# Altium schematic sheet CSGB.SchDoc
size A4
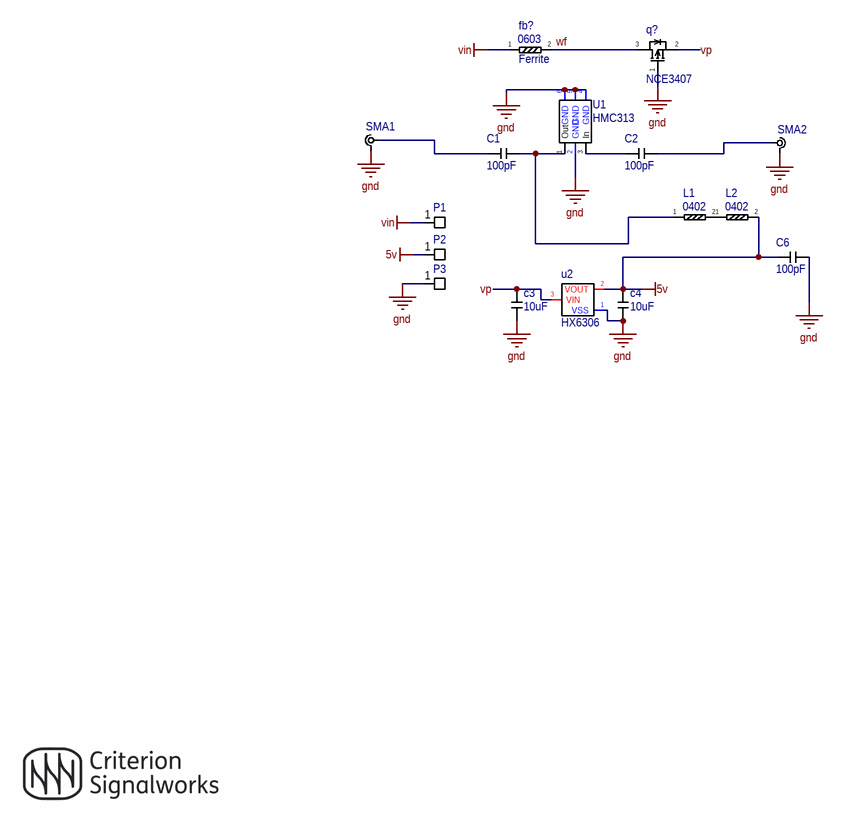
[diagram p0: CSGB.SchDoc]

## Parts
C1  100pF  [CS-0402!]
C2  100pF  [CS-0402!]
c3  10uF  [CS-0603]
c4  10uF  [CS-0603]
C6  100pF  [CS-0402!]
fb?  Ferrite  [CS-0603Perfect]
L1  0402-Generic  [CS-0402!]  (value not drawn)
L2  0402-Generic  [CS-0402!]  (value not drawn)
P1  CS-PH-1  [CS-PH-1]  (value not drawn)
P2  CS-PH-1  [CS-PH-1]  (value not drawn)
P3  CS-PH-1  [CS-PH-1]  (value not drawn)
q?  NCE3407  [SOT-23-3-Extended]
SMA1  CS-RF-SMA-V2  [CS-RF-SMA-V2]  (value not drawn)
SMA2  CS-RF-SMA-V2  [CS-RF-SMA-V2]  (value not drawn)
U1  HMC313  [SOT-23-6]
u2  HX6306  [SOT-23-3-Extended]

## Nets
5v: c4.2 C6.1 L2.2 P2.1 u2.2(VOUT)
gnd: c3.1 c4.1 C6.2 P3.1 q?.1 SMA1.2 SMA2.2 U1.2(GND) U1.4(GND) U1.5(GND) U1.6(GND) u2.1(VSS)
vin: fb?.1 P1.1
vp: c3.2 q?.2 u2.3(VIN)
wf: fb?.2 q?.3
NetC1_1: C1.1 SMA1.1
NetC1_2: C1.2 L1.1 U1.1(Out)
NetC2_1: C2.1 U1.3(In)
NetC2_2: C2.2 SMA2.1
NetL1_2: L1.2 L2.1

## Notes on the sheet
- Title
- Size:
- Date:
- File:
- A2
- Number:
- Time:
- Revision:
- Sheet
- of
- (in symbol 0402-Generic) 0402
- (in symbol 0603-Generic) 0603

## Library data of the parts
C1 C2 C6 = C0402!
c3 c4 = C0603
fb? = 0603-Generic
q? = NCE3407: P-Ch En MOSFET; LCSC Part #: C113770
u2 = HX6306: LDO